# EAGLE schematic auxboxshield1.7test (EAGLE 6.5.0)
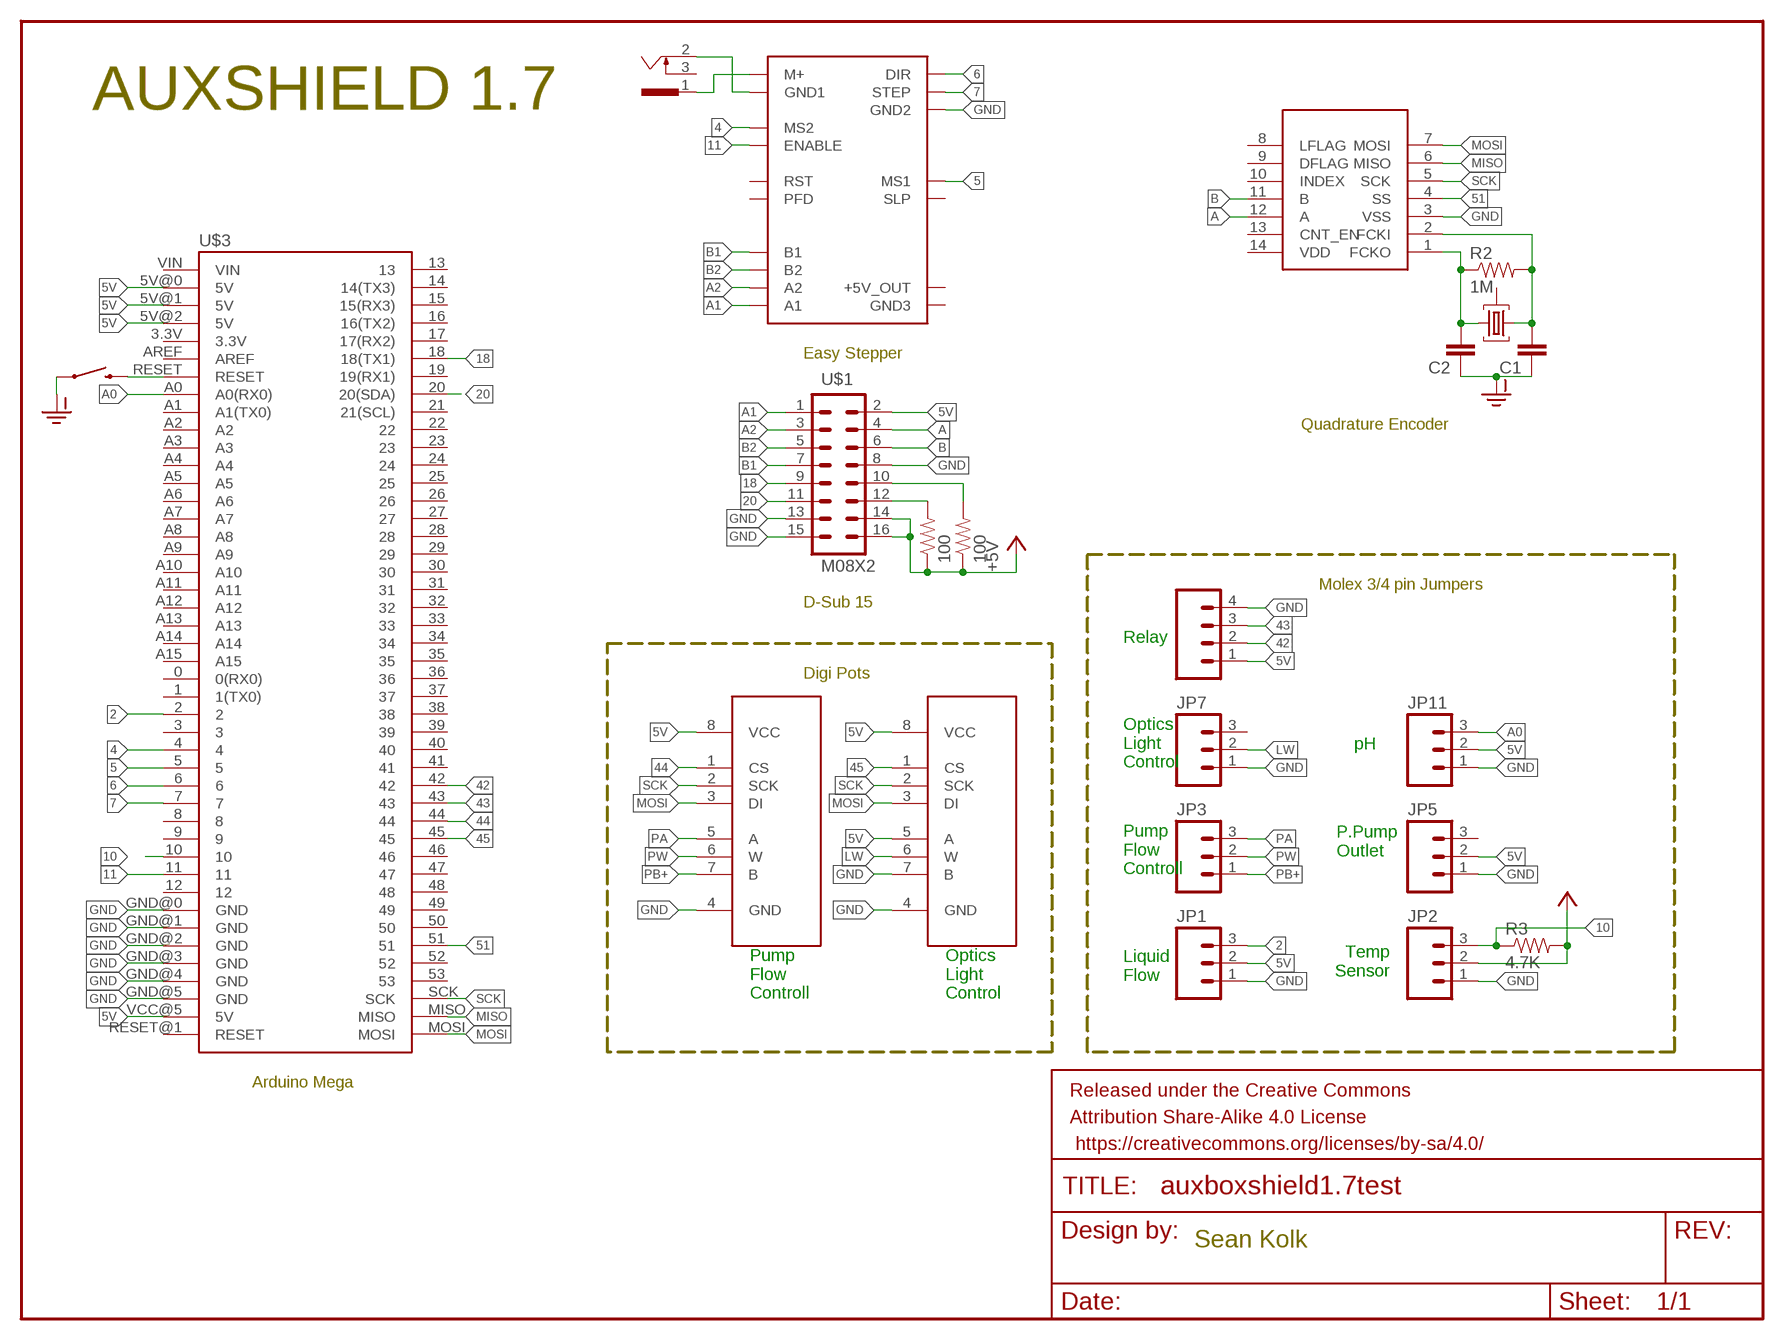
[diagram p0: schematic, sheet 1]

## Parts
C1  0.1UF-50V-20%(PTH)KIT-EZ  [CAP-PTH-SMALL-KIT]
C2  0.1UF-50V-20%(PTH)KIT-EZ  [CAP-PTH-SMALL-KIT]
EASYDRIVER_V44  EASYDRIVER_V44  [EASYDRIVER_V44]
FRAME1  FRAME-LETTER  [CREATIVE_COMMONS]
JP1  M03POLAR  [MOLEX-1X3]
JP2  M03POLAR  [MOLEX-1X3]
JP3  M03POLAR  [MOLEX-1X3]
JP5  M03POLAR  [MOLEX-1X3]
JP7  M03POLAR  [MOLEX-1X3]
JP11  M03POLAR  [MOLEX-1X3]
PUMPDIGIPOT  MCP41XXXDIL  [DIL-08]
QF1  21M30AUM5  [UM5]
R1  100  10OHM-1/4W-5%(PTH)  [AXIAL-0.3]
R2  1M  10OHM-1/4W-5%(PTH)  [AXIAL-0.3]
R3  4.7K  10OHM-1/4W-5%(PTH)  [AXIAL-0.3]
R4  100  10OHM-1/4W-5%(PTH)  [AXIAL-0.3]
RELAY  M04POLAR  [MOLEX-1X4]
S1  SWITCH-MOMENTARY-2PTH_EZ  [TACTILE-PTH-EZ]
U1  MCP41XXXDIL  [DIL-08]
U$1  M08X2  [2X8]
U$2  LS7366R  [SO014]
U$3  ARDUINO-MEGA-V2  [ARDUINO_MEGA-PRO-5V]
X1  SCD-014A  [SCD-014-A]

## Nets
2: JP1.3 U$3.2
4: EASYDRIVER_V44.MS2 U$3.4
5: EASYDRIVER_V44.MS1 U$3.5
5V: JP1.2 JP5.2 JP11.2 PUMPDIGIPOT.8(VCC) RELAY.1 U1.5(A) U1.8(VCC) U$1.2 U$3.5V@0(5V) U$3.5V@1(5V) U$3.5V@2(5V) U$3.VCC@5(5V)
6: EASYDRIVER_V44.DIR U$3.6
7: EASYDRIVER_V44.STEP U$3.7
10: JP2.3 R3.P$1 U$3.10
11: EASYDRIVER_V44.ENABLE U$3.11
18: U$1.9 U$3.18(18(TX1))
20: U$1.11 U$3.20(20(SDA))
42: RELAY.2 U$3.42
43: RELAY.3 U$3.43
44: PUMPDIGIPOT.1(CS) U$3.44
45: U1.1(CS) U$3.45
51: U$2.4(SS) U$3.51
+5V: JP2.2 R1.P$1 R3.P$2 R4.P$1 U$1.14 U$1.16
A: U$1.4 U$2.12(A)
A0: JP11.3 U$3.A0(A0(RX0))
A1: EASYDRIVER_V44.A1 U$1.1
A2: EASYDRIVER_V44.A2 U$1.3
B: U$1.6 U$2.11(B)
B1: EASYDRIVER_V44.B1 U$1.7
B2: EASYDRIVER_V44.B2 U$1.5
GND: EASYDRIVER_V44.GND2 JP1.1 JP2.1 JP5.1 JP7.1 JP11.1 PUMPDIGIPOT.4(GND) RELAY.4 U1.4(GND) U1.7(B) U$1.8 U$1.13 U$1.15 U$2.3(VSS) U$3.GND@0(GND) U$3.GND@1(GND) U$3.GND@2(GND) U$3.GND@3(GND) U$3.GND@4(GND) U$3.GND@5(GND)
GND-ISO: C1.1 C2.1 S1.1
LW: JP7.2 U1.6(W)
MISO: U$2.6(MISO) U$3.MISO
MOSI: PUMPDIGIPOT.3(DI) U1.3(DI) U$2.7(MOSI) U$3.MOSI
N$1: EASYDRIVER_V44.M+ X1.1
N$4: R1.P$2 U$1.10
N$6: EASYDRIVER_V44.GND1 X1.2
N$9: S1.3 U$3.RESET
N$12: C1.2 QF1.1 R2.P$2 U$2.2(FCKI)
N$25: C2.2 QF1.3 R2.P$1 U$2.1(FCKO)
N$33: R4.P$2 U$1.12
PA: JP3.3 PUMPDIGIPOT.5(A)
PB+: JP3.1 PUMPDIGIPOT.7(B)
PW: JP3.2 PUMPDIGIPOT.6(W)
SCK: PUMPDIGIPOT.2(SCK) U1.2(SCK) U$2.5(SCK) U$3.SCK
Unconnected: EASYDRIVER_V44.GND3 EASYDRIVER_V44.P$11(+5V_OUT) EASYDRIVER_V44.PFD EASYDRIVER_V44.RST EASYDRIVER_V44.SLEEP(SLP) JP5.3 JP7.3 QF1.2 U$2.8(LFLAG) U$2.9(DFLAG) U$2.10(INDEX) U$2.13(CNT_EN) U$2.14(VDD) U$3.0(0(RX0)) U$3.1(1(TX0)) U$3.3 U$3.3.3V U$3.8 U$3.9 U$3.12 U$3.13 U$3.14(14(TX3)) U$3.15(15(RX3)) U$3.16(16(TX2)) U$3.17(17(RX2)) U$3.19(19(RX1)) U$3.21(21(SCL)) U$3.22 U$3.23 U$3.24 U$3.25 U$3.26 U$3.27 U$3.28 U$3.29 U$3.30 U$3.31 U$3.32 U$3.33 U$3.34 U$3.35 U$3.36 U$3.37 U$3.38 U$3.39 U$3.40 U$3.41 U$3.46 U$3.47 U$3.48 U$3.49 U$3.50 U$3.52 U$3.53 U$3.A1(A1(TX0)) U$3.A2 U$3.A3 U$3.A4 U$3.A5 U$3.A6 U$3.A7 U$3.A8 U$3.A9 U$3.A10 U$3.A11 U$3.A12 U$3.A13 U$3.A14 U$3.A15 U$3.AREF U$3.RESET@1(RESET) U$3.VIN X1.3

## Notes on the sheet
- AUXSHIELD 1.7
- Easy Stepper
- Quadrature Encoder
- Molex 3/4 pin Jumpers
- D-Sub 15
- Relay
- Digi Pots
- pH
- Optics
  Light 
  Control
- P.Pump 
  Outlet
- Pump
  Flow
  Controll
- Temp
  Sensor
- Liquid 
  Flow
- Pump
  Flow
  Controll
- Optics
  Light
  Control
- Arduino Mega
- Sean Kolk

## Library data of the parts
C1 C2 = SparkFun-Capacitors:0.1UF-50V-20%(PTH): CAP-08370; PROD_ID: CAP-08370
EASYDRIVER_V44 = EasyDriver:EASYDRIVER_V44: EasyDriver version 4.4 - http://www.schmalzhaus.com/EasyDriver
FRAME1 = SparkFun-Aesthetics:FRAME-LETTER: Schematic Frame Standard 8.5x11 US Letter frame
JP1-JP3 JP5 JP7 JP11 = SparkFun-Connectors:M03: Header 3 Standard 3-pin 0.1" header. Use with straight break away headers (SKU : PRT-00116), right angle break away headers (PRT-00553), swiss pins (PRT-00743), machine pins (PRT-00117), and female headers (PRT-00115). Molex polarized connector foot print use with SKU : PRT-08232 with associated crimp pins and housings.
PUMPDIGIPOT U1 = SparkFun-AnalogIC:MCP41XXX: SPI controlled single digital potentiometer by Microchip PID: COM-10613
QF1 = crystal:21M*A: Monolithic Crystal Filters Source: www.vanlong.com; OC_FARNELL: unknown; OC_NEWARK: unknown
R1-R4 = SparkFun-Resistors:10OHM-1/4W-5%(PTH): RES-10698; PROD_ID: RES-10698; VALUE: 10
RELAY = SparkFun-Connectors:M04: Header 4 Standard 4-pin 0.1" header. Use with straight break away headers (SKU : PRT-00116), right angle break away headers (PRT-00553), swiss pins (PRT-00743), machine pins (PRT-00117), and female headers (PRT-00115). Molex polarized connector foot print use with SKU : PRT-08231 with associated crimp pins and housings. 1MM SMD Version SKU: PRT-10208
S1 = SparkFun-Electromechanical:SWITCH-MOMENTARY-2: Various NO switches- pushbuttons, reed, etc
U$1 = SparkFun-Connectors:M08X2: .1" headers, two rows of 8 each
U$2 = SparkFun-DigitalIC:LS7366R
U$3 = MEGASHIELD2:ARDUINO-MEGA-V2
X1 = con-shiua-chyuan:SCD-014A: Power Jack 2.5mm; OC_FARNELL: unknown; OC_NEWARK: unknown